# Altium project ADUM1411.PrjPcb
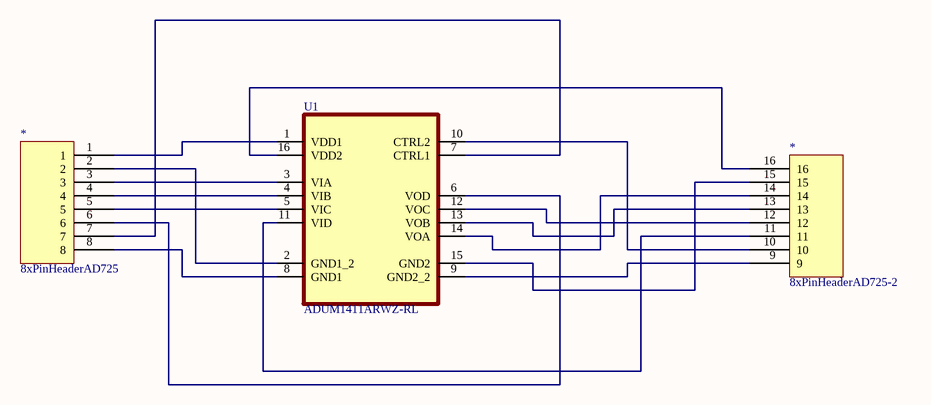
[diagram p0: Sheet1.SchDoc]
1 sheet, 3 parts. Net scope: global (net labels, ports and power ports of the same name join across sheets).
Board file: PCB1.PcbDoc

## Sheet Sheet1.SchDoc
size A4

### Parts
(Parts that share a designator on the sheet are numbered #1, #2 ... from top to bottom, then left to right.)
*#1  8xPinHeaderAD725  [8xHeaderAD725-1]
*#2  8xPinHeaderAD725-2  [8xHeaderAD725-2]
U1  ADUM1411ARWZ-RL  [SOIC127P1032X265-16N]

### Nets
Net*#1_1: *#1.1 U1.1(VDD1)
Net*#1_2: *#1.2 U1.2(GND1_2)
Net*#1_3: *#1.3 U1.3(VIA)
Net*#1_4: *#1.4 U1.4(VIB)
Net*#1_5: *#1.5 U1.5(VIC)
Net*#1_6: *#1.6 U1.6(VOD)
Net*#1_7: *#1.7 U1.7(CTRL1)
Net*#1_8: *#1.8 U1.8(GND1)
Net*#2_9: *#2.9 U1.9(GND2_2)
Net*#2_10: *#2.10 U1.10(CTRL2)
Net*#2_11: *#2.11 U1.11(VID)
Net*#2_12: *#2.12 U1.12(VOC)
Net*#2_13: *#2.13 U1.13(VOB)
Net*#2_14: *#2.14 U1.14(VOA)
Net*#2_15: *#2.15 U1.15(GND2)
Net*#2_16: *#2.16 U1.16(VDD2)

### Library data of the parts
U1 = ADUM1411ARWZ-RL: General Purpose Digital Isolator 3750Vrms 4 Channel 1Mbps 25kV/Âµs CMTI 16-SOIC (0.295, 7.50mm Width); MF: Analog Devices; Digi-Key_Part_Number: ADUM1411ARWZ-RLCT-ND; Check_prices: https://www.snapeda.com/parts/ADUM1411ARWZ-RL/Analog%20Devices%20Inc./view-part/218128/?ref=eda; SnapEDA_Link: https://www.snapeda.com/parts/ADUM1411ARWZ-RL/Analog%20Devices%20Inc./view-part/218128/?ref=snap; Package: SOIC -16 Analog Devices; Purchase-URL: https://pricing.snapeda.com/search/part/ADUM1411ARWZ-RL/?ref=eda; Value: *; MP: ADUM1411ARWZ-RL